# EAGLE schematic temp_brick_smd (EAGLE 7.2.0)
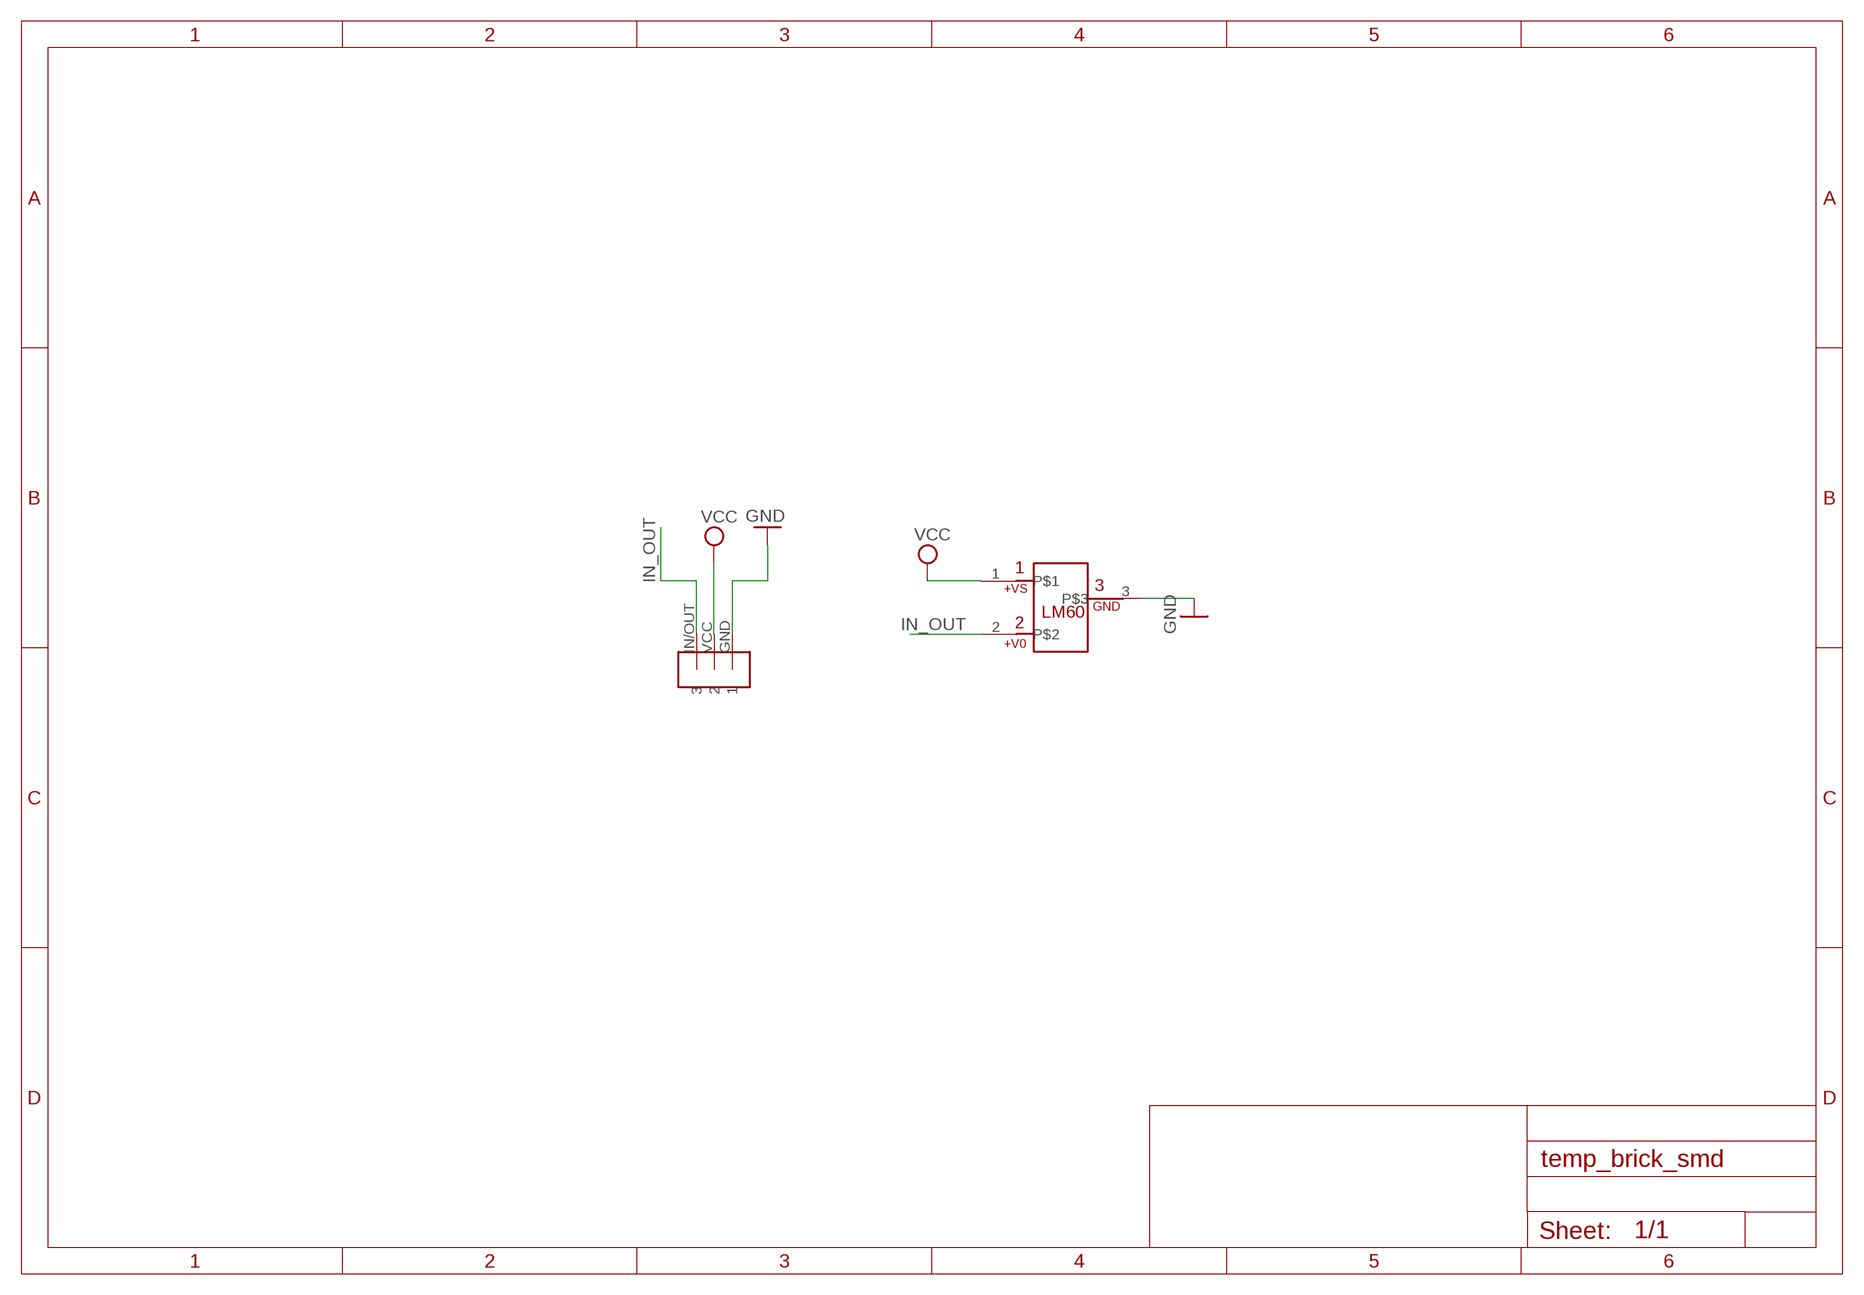
[diagram p0: schematic, sheet 1]

## Parts
U$1  SENSOR-LM60  [SENSOR-LM60]
U$2  BRICK-3PIN  [BRICK_3PIN]

## Nets
GND: U$1.3 U$2.GND
IN_OUT: U$1.2 U$2.IN/OUT
VCC: U$1.1 U$2.VCC

## Library data of the parts
U$1 = gclue:SENSOR-LM60
U$2 = gclue:BRICK-3PIN